# EasyEDA Pro project 主轴照明灯.eprj

# Schematic 原理图
Board Name: ESP32s3; Create Date: 2025-05-14; Page Name: 电源; Project Name: 主轴照明灯; Schematic Name: 原理图; Update Date: 2026-03-25; Company: 嘉立创EDA; Page Size: A3; Version: V1.0
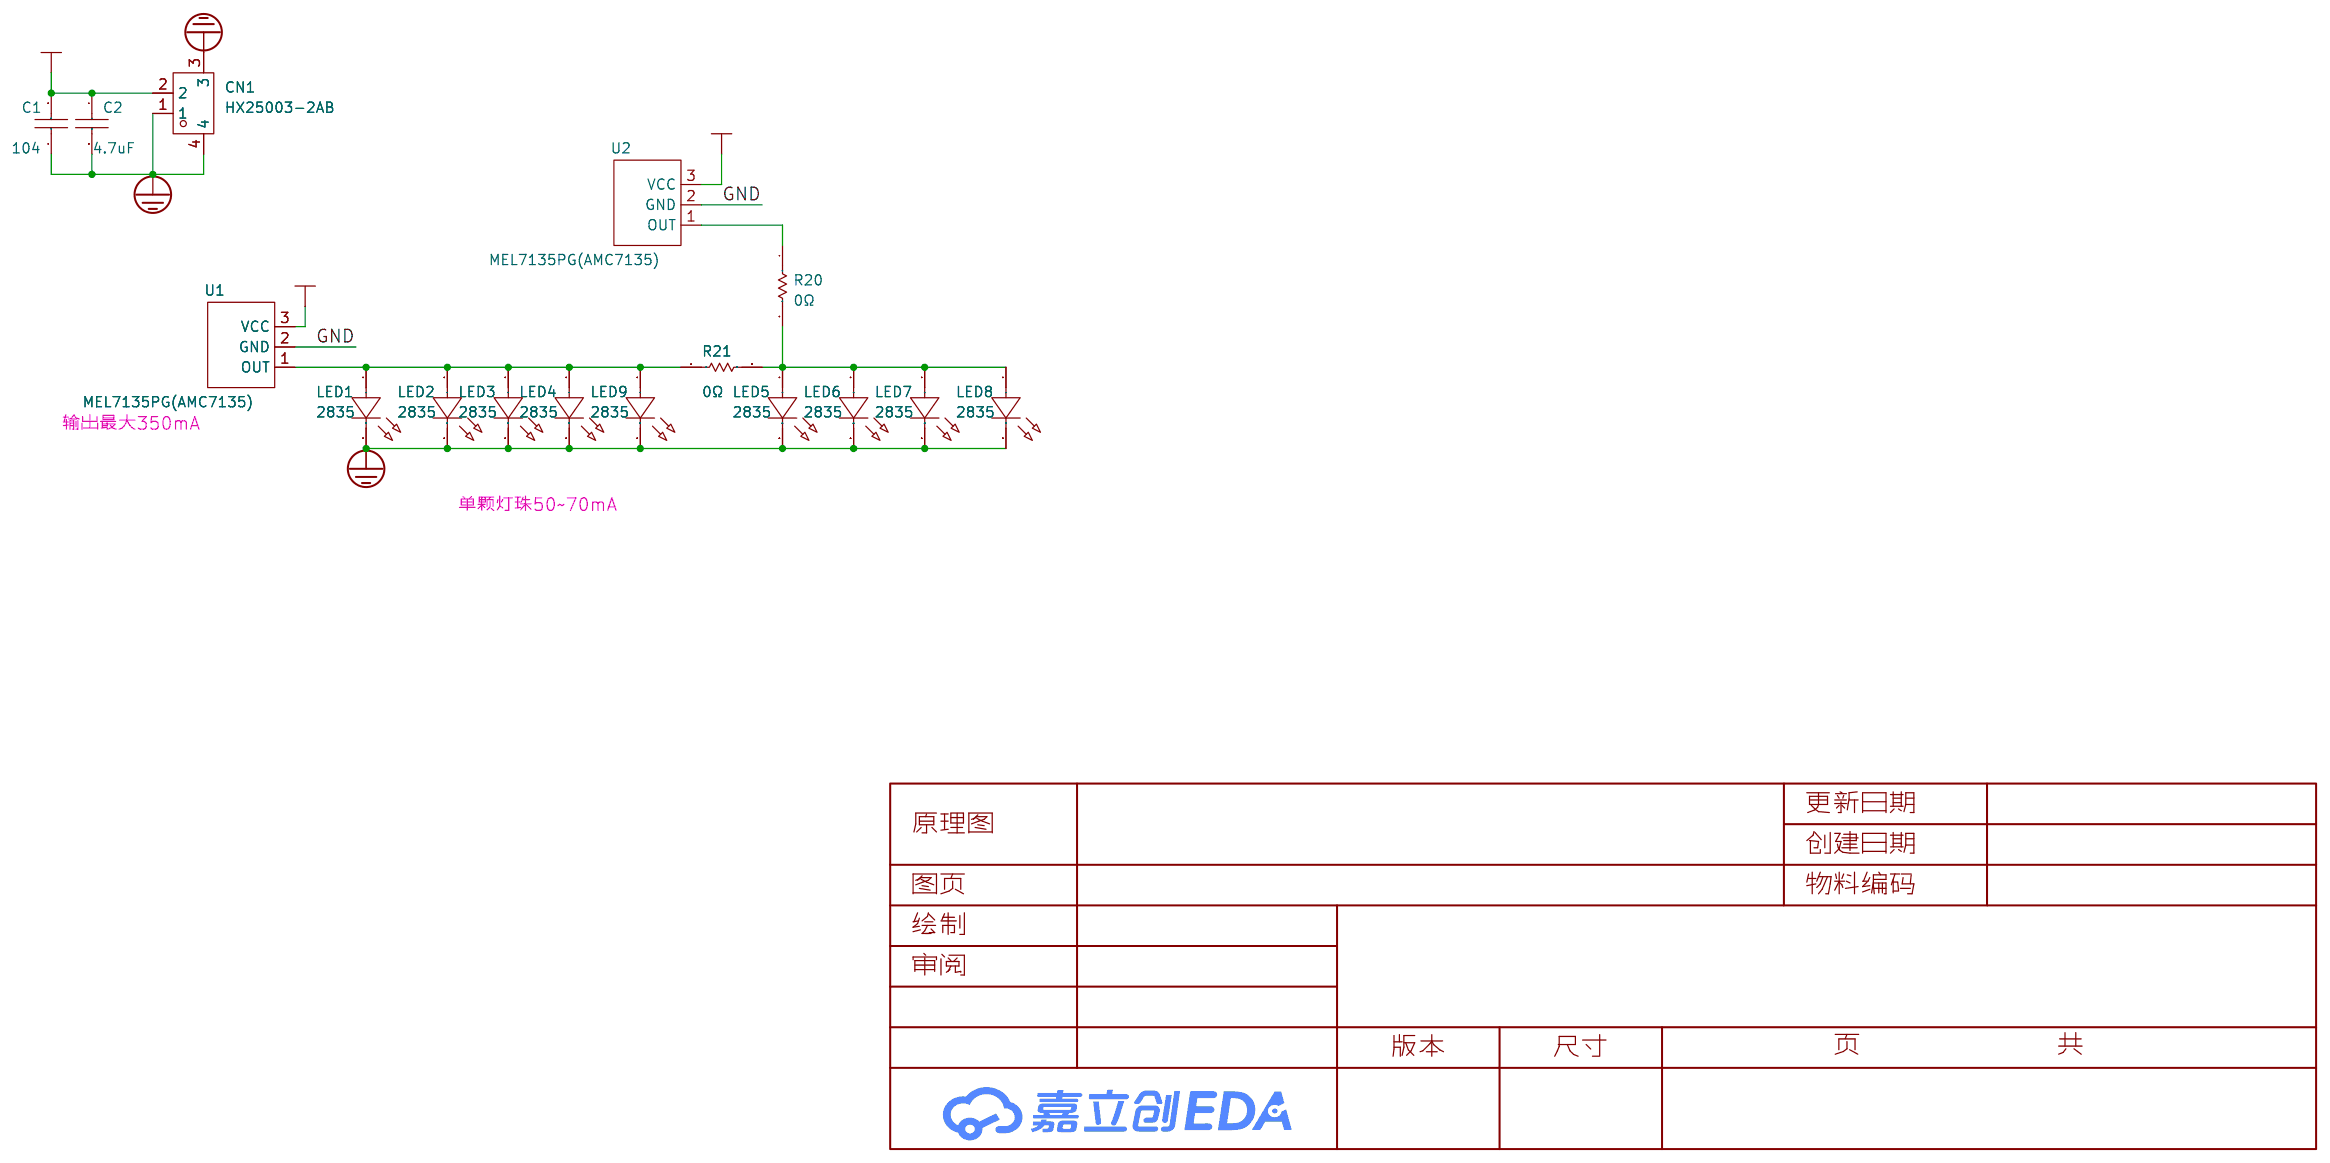
[diagram p0: schematic sheet]

## Parts
C1  104  [0603C]
C2  4.7uF  [0805C]
CN1  HX25003-2AB  [CONN-SMD_P2.50_HX25003-2AB]
LED1  2835  [LED-SMD_L3.5-W2.8_2835]
LED2  2835  [LED-SMD_L3.5-W2.8_2835]
LED3  2835  [LED-SMD_L3.5-W2.8_2835]
LED4  2835  [LED-SMD_L3.5-W2.8_2835]
LED5  2835  [LED-SMD_L3.5-W2.8_2835]
LED6  2835  [LED-SMD_L3.5-W2.8_2835]
LED7  2835  [LED-SMD_L3.5-W2.8_2835]
LED8  2835  [LED-SMD_L3.5-W2.8_2835]
LED9  2835  [LED-SMD_L3.5-W2.8_2835]
R20  0Ω  [10]
R21  0Ω  [10]
U1  MEL7135PG(AMC7135)  [SOT-89-3_L4.5-W2.5-P1.50-LS4.2-BR]
U2  MEL7135PG(AMC7135)  [SOT-89-3_L4.5-W2.5-P1.50-LS4.2-BR]

## Library data of the parts
C1 = 104: Capacitor (Semiconductor SIM Model); Published: 8-Jun-2000; LatestRevisionDate: 17-Jul-2002; LatestRevisionNote: Re-released for DXP Platform.; PackageReference: C1206; Publisher: Altium Limited; Origin Footprint 2: C1206; Origin Footprint 3: 0402; Origin Footprint 4: 1310[0504]; Origin Footprint 5: 1608[0603]; Origin Footprint 6: C1210; Origin Footprint 7: C0805; Origin Footprint 8: C1206; Origin Footprint 9: 0805; Origin Footprint 10: 0805L; Design Item ID: Cap Semi; Library Name: Miscellaneous Devices
C2 = 105: Design Item ID: CAP; Library Name: SCH--װ--
CN1 = HX25003-2AB: LCSC Part Name: 1x2P 间距:2.5mm 立贴 系列:XH; Supplier Part: C442354; Manufacturer: HX(红星); Supplier Footprint: SMD,P=2.5mm; JLCPCB Part Class: 扩展库; Datasheet: https://item.szlcsc.com/datasheet/HX25003-2AB/442586.html; Supplier: LCSC; Pins Structure: 1x2P; Pitch: 2.5mm; Mounting Type: 立贴; Reference Series: XH; Number of Pins: 2P; Number of Rows: 1; Number of PINs Per Row: 2; Current Rating: 3A; Contact Material: 黄铜; Contact Plating: 锡; Operating Temperature: -25℃~+85℃; Voltage Rating: 250V; Plastic Material: PA66; Flame Retardant Rating: UL94V-0; Color: 白色
LED1-LED9 = 2835: Supplier Part: C9900165166; Supplier Footprint: SMD; Supplier: LCSC
R20 R21 = 10K: Resistor; Published: 8-Jun-2000; LatestRevisionDate: 17-Jul-2002; LatestRevisionNote: Re-released for DXP Platform.; PackageReference: AXIAL-0.3; Publisher: Altium Limited; Origin Footprint 2: AXIAL-0.3; Origin Footprint 3: R0805; Origin Footprint 4: 0805R; Origin Footprint 1: 0603R; Design Item ID: RES; Library Name: SCH封装库
U1 U2 = MEL7135PG: LCSC Part Name: 电流调节器; Supplier Part: C80214; Manufacturer: MICRONE(南京微盟); Supplier Footprint: SOT-89; JLCPCB Part Class: 扩展库; Datasheet: https://item.szlcsc.com/datasheet/MEL7135PG/81359.html; Supplier: LCSC; Voltage - Input(DC): 2.7V~6V; Number of Channels: 1; Output Current: 350mA; Operating temperature: -40℃~+85℃

## Nets
5V_VCC: C1.2 C2.1 CN1.2 U1.3(VCC) U2.3(VCC)
GND: C1.1 C2.2 CN1.1 CN1.3 CN1.4 LED1.2(C) LED2.2(C) LED3.2(C) LED4.2(C) LED5.2(C) LED6.2(C) LED7.2(C) LED8.2(C) LED9.2(C) U1.2(GND) U2.2(GND)
$9N287556: LED5.1(A) LED6.1(A) LED7.1(A) LED8.1(A) R20.2 R21.2
$9N287562: LED1.1(A) LED2.1(A) LED3.1(A) LED4.1(A) LED9.1(A) R21.1 U1.1(OUT)
$9N287640: R20.1 U2.1(OUT)

## Notes on the sheet
- 输出最大350mA
- 单颗灯珠50~70mA

# Board PCB
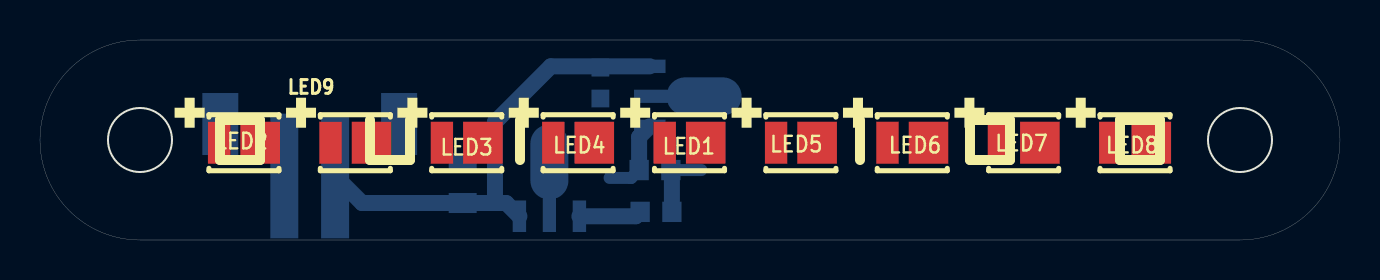
[diagram p1: board, top side]
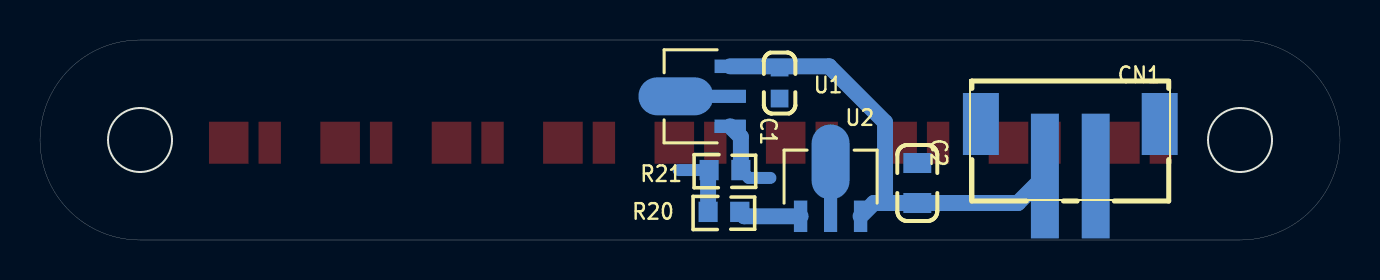
[diagram p2: board, bottom side, seen from below]

Outline 65 x 10 mm; copper layers: Top Layer, Bottom Layer. Coordinates in mm from the lower left corner of the outline.
Outline path: circle c5,5 r1.6 ; circle c60,5 r1.6 ; 5,10 60,10 arc(65,5) 60,0 5,0 arc(0,5) 5,10
Stack: Top Layer 0.035mm / Dielectric1 1.51mm FR4 er 4.5 / Bottom Layer 0.035mm

## Design rules (mm)
template: 用户自定义配置
spacing Default (default): track to track 0.152, other pairs 0 to 0.152
track width Default (default): min 0.254, default 0.254, max 25.4
differential pair differentialPair (default): width min 0.127, default 0.254, max 2.54; gap min 0.152, default 0.152
via Default (default): diameter min 0.25, default 0.61, max 100.025; hole min 0.2, default 0.305, max 59.995

## Placement (name value [footprint] x y rotation side)
C1  104  [0603C]  28.02 7.85 90 bottom
C2  4.7uF  [0805C]  21.14 2.85 90 bottom
CN1  HX25003-2AB  [CONN-SMD_P2.50_HX25003-2AB]  13.49 4.12 0 bottom
LED1  2835  [LED-SMD_L3.5-W2.8_2835]  32.26 4.86 0 top
LED2  2835  [LED-SMD_L3.5-W2.8_2835]  9.98 4.86 0 top
LED3  2835  [LED-SMD_L3.5-W2.8_2835]  21.12 4.86 0 top
LED4  2835  [LED-SMD_L3.5-W2.8_2835]  26.69 4.86 0 top
LED5  2835  [LED-SMD_L3.5-W2.8_2835]  37.83 4.86 0 top
LED6  2835  [LED-SMD_L3.5-W2.8_2835]  43.4 4.86 0 top
LED7  2835  [LED-SMD_L3.5-W2.8_2835]  48.97 4.86 0 top
LED8  2835  [LED-SMD_L3.5-W2.8_2835]  54.54 4.86 0 top
LED9  2835  [LED-SMD_L3.5-W2.8_2835]  15.55 4.86 0 top
R20  0Ω  [10]  29.91 1.52 0 bottom
R21  0Ω  [10]  29.86 3.61 0 bottom
U1  MEL7135PG(AMC7135)  [SOT-89-3_L4.5-W2.5-P1.50-LS4.2-BR]  31.85 7.18 180 bottom
U2  MEL7135PG(AMC7135)  [SOT-89-3_L4.5-W2.5-P1.50-LS4.2-BR]  25.47 2.54 270 bottom

## Footprints (pads in the part's own frame, mm; a bottom-side part is the same pattern mirrored in y, then rotated)
10
  rect 0.965x1.016 smd: 1(0.101,0.117) 2(1.688,0.117)
0603C
  rect 0.889x0.889 smd: 1(-0.774,0) 2(0.774,0)
0805C
  rect 1x1.4 smd: 1(-1,0) 2(1,0)
CONN-SMD_P2.50_HX25003-2AB
  rect 1.4x6.24 smd: 1(-1.27,0.925) 2(1.27,0.925)
  rect 1.8x3.1 smd: 3(4.47,-1.675) 4(-4.47,-1.675)
LED-SMD_L3.5-W2.8_2835
  rect 1.12x2.1 smd: 1(-1.025,0)
  rect 1.98x2.1 smd: 2(1.025,0)
SOT-89-3_L4.5-W2.5-P1.50-LS4.2-BR
  rect 1.575x0.672 smd: 1(1.356,-1.5) 3(1.356,1.5)
  custom 5.377x1.9 smd: 2(-1.356,0)

## Nets
As in the schematic.

## Routing (per net, layer and track width the routed paths; a pad name or vN(x,y) marks a point on that pad's centre or on a via; arc(x,y) is an arc through that point)
5V_VCC: length 23
  Bottom Layer w0.8: 22.75,1.85 22.75,5.89 25.54,8.68 U1.3 ; 22.75,1.85 C2.1 16.11,1.85 14.76,3.2 ; 22.75,1.85 23.31,1.85 U2.3
$9N287556: length 3.6
  Bottom Layer w0.6: R21.2 33.07,3.5
  Bottom Layer w0.8: R20.2 31.6,3.45 R21.2
$9N287562: length 4
  Bottom Layer w0.6: 28.48,3.1 29.56,3.1 R21.1
  Bottom Layer w0.8: U1.1 29.96,5.15 R21.1
$9N287640: length 3.1
  Bottom Layer w0.8: R20.1 29.79,1.19 U2.1
